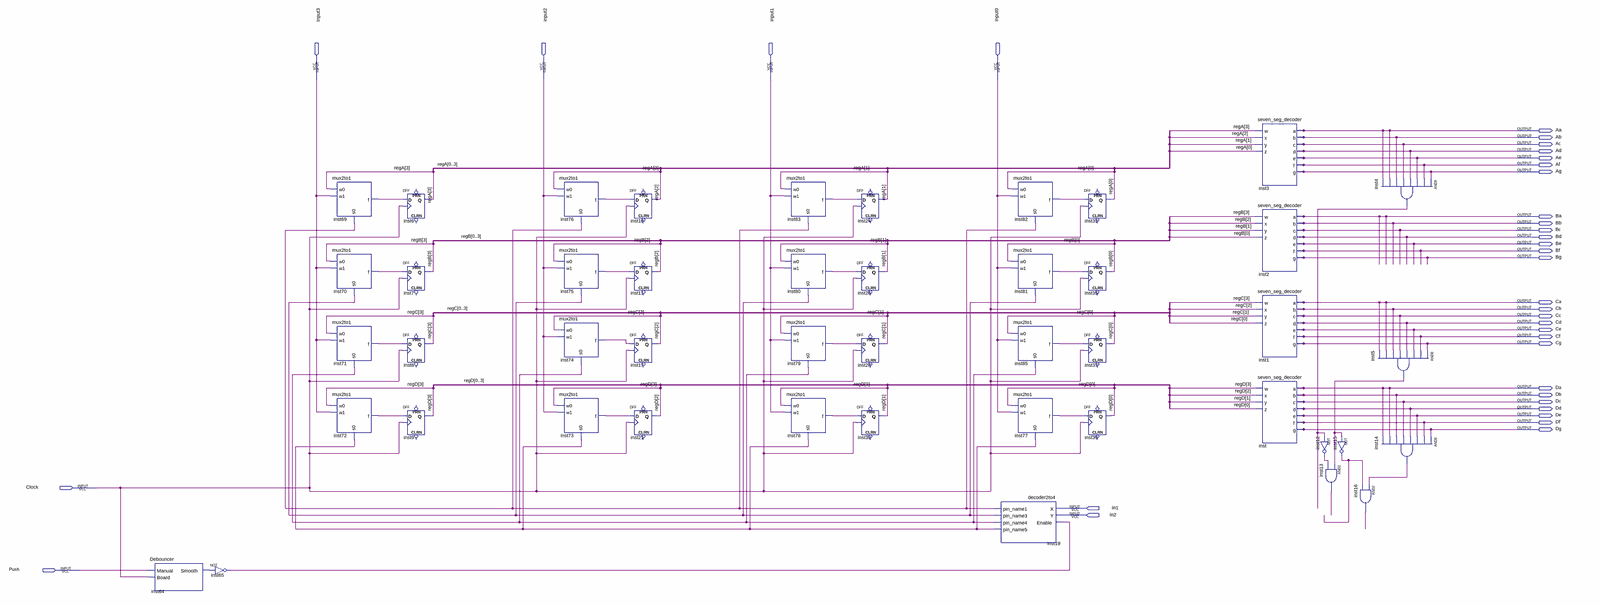
[diagram p0: schematic sheet, whole]
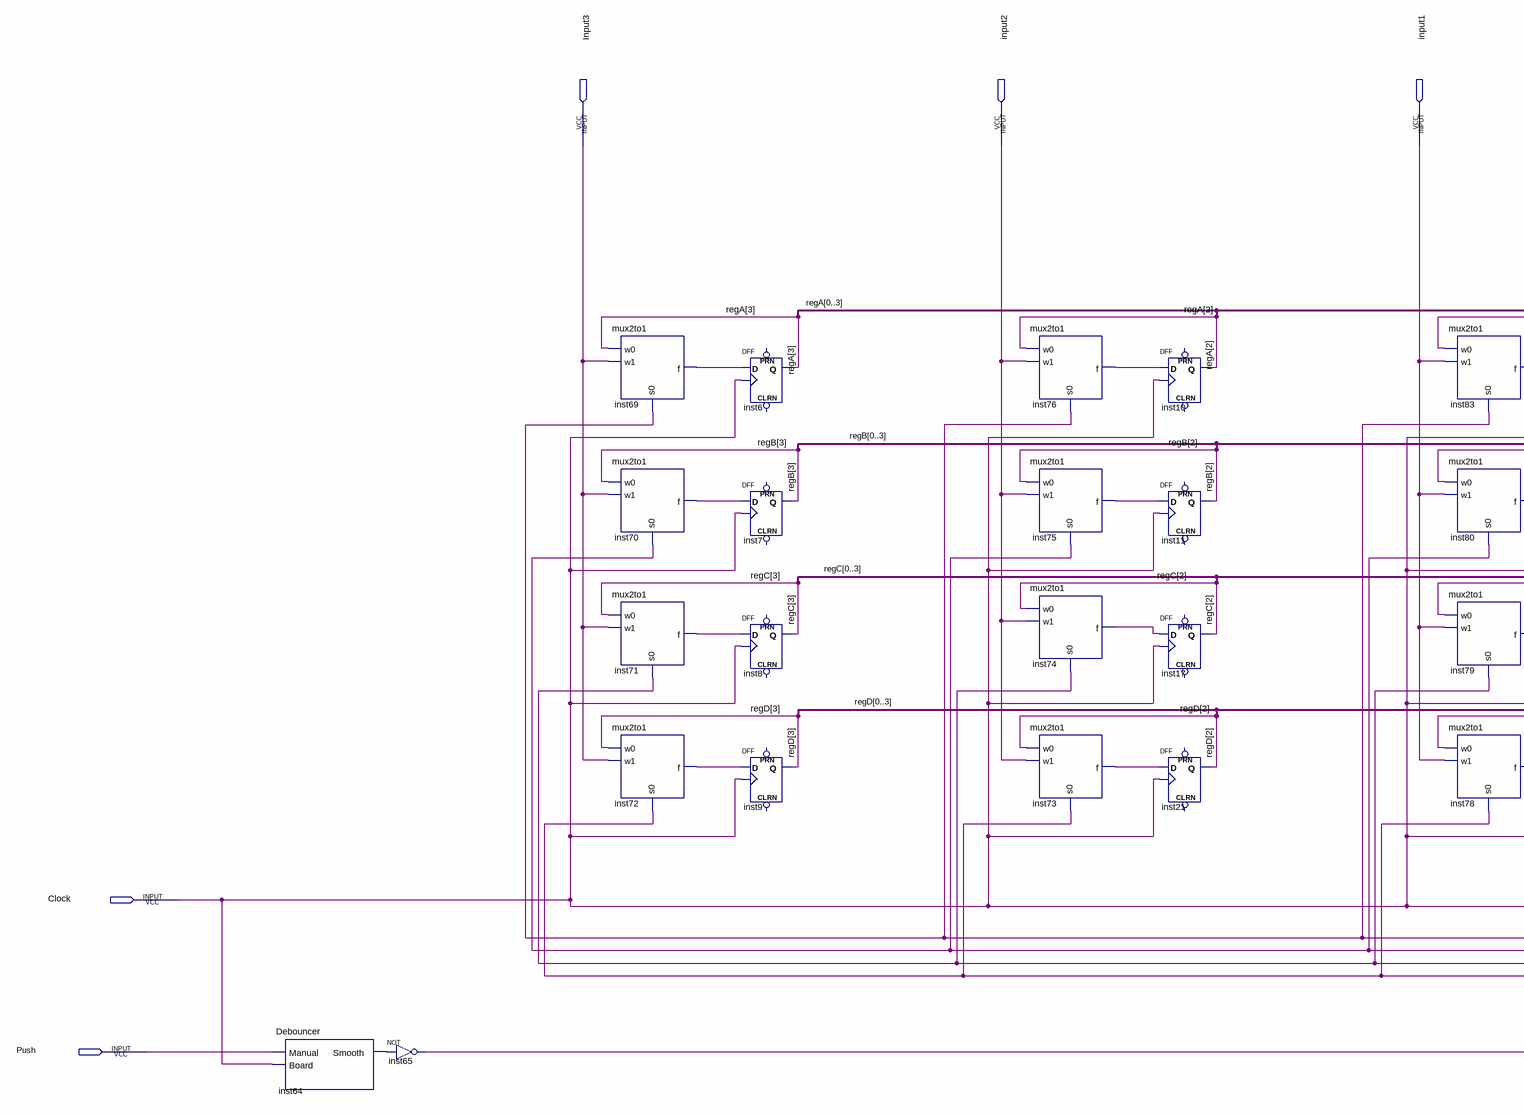
[diagram p1: schematic sheet, left part]
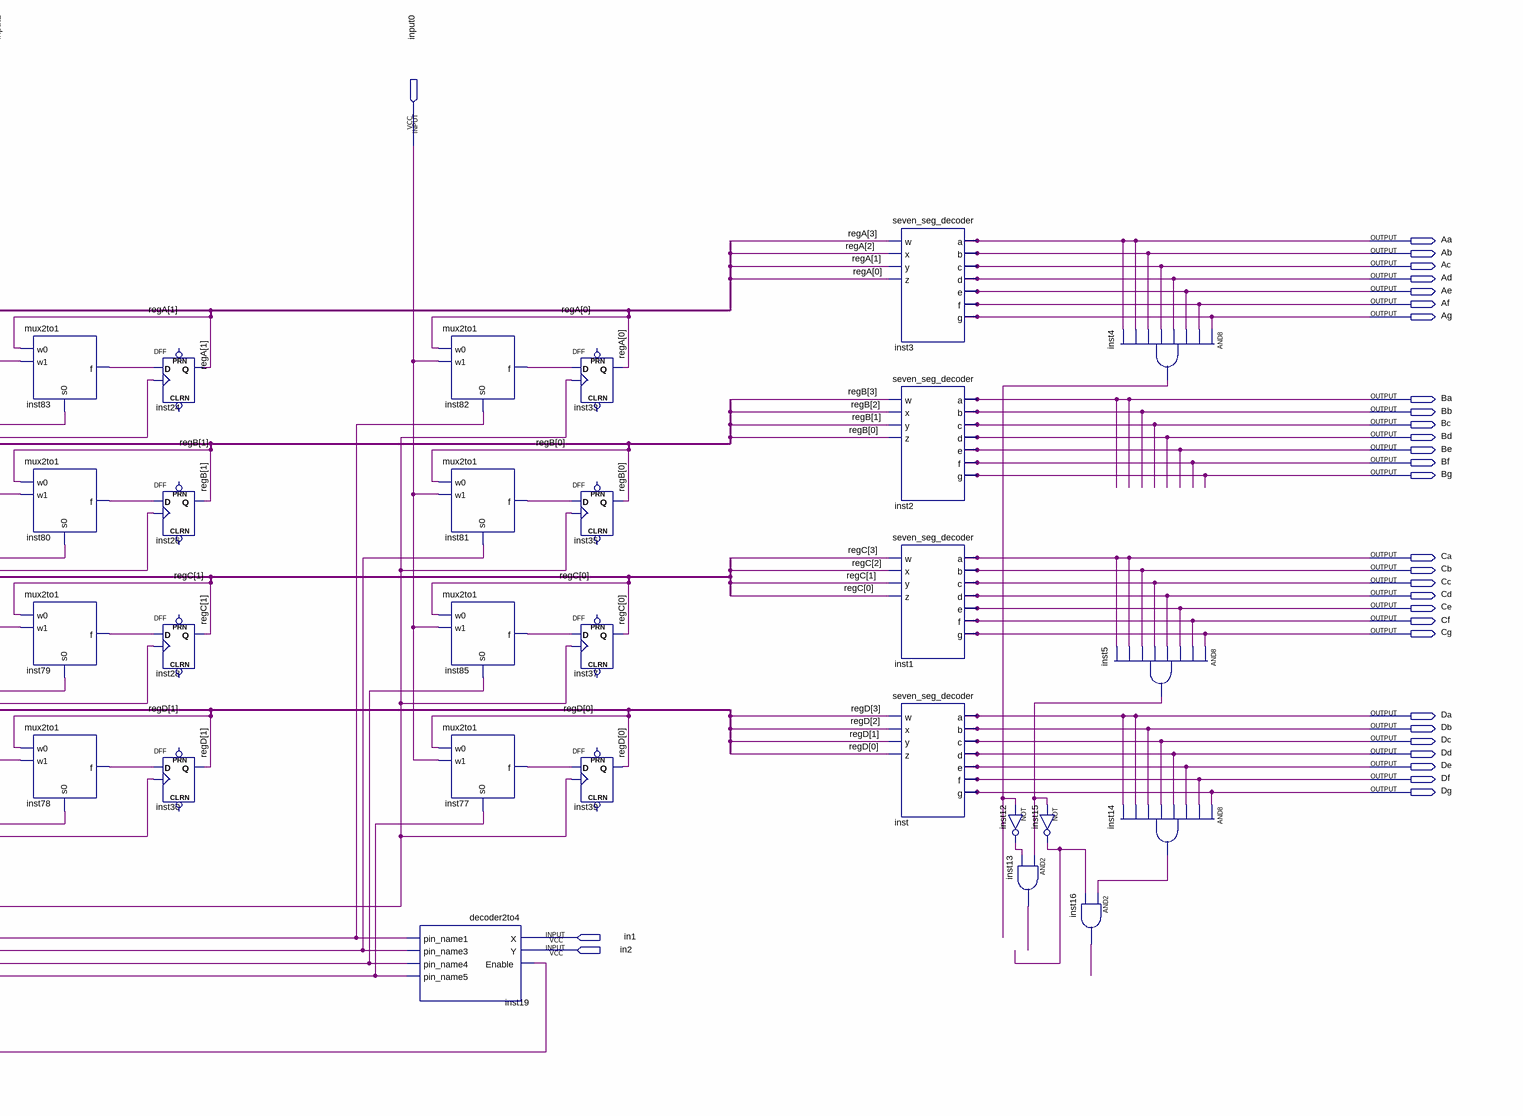
[diagram p2: schematic sheet, right part]
// Quartus schematic register.bdf as structural Verilog: 46 symbols, 36 pins
module register (
  input  Input3,
  input  input2,
  input  input1,
  input  input0,
  input  Clock,
  input  in1,
  input  in2,
  input  Push,
  output Aa,
  output Ab,
  output Ac,
  output Ad,
  output Ae,
  output Af,
  output Ag,
  output Ba,
  output Bb,
  output Bc,
  output Bd,
  output Be,
  output Bf,
  output Bg,
  output Ca,
  output Cb,
  output Cc,
  output Cd,
  output Ce,
  output Cf,
  output Cg,
  output Da,
  output Db,
  output Dc,
  output Dd,
  output De,
  output Df,
  output Dg
);

  wire inst4_out, inst5_out, inst12_out, inst13_out, inst14_out, inst15_out, inst16_out, inst19_pin_name1,
       inst19_pin_name3, inst19_pin_name4, inst19_pin_name5, inst64_smooth, inst65_out, inst69_f, inst70_f,
       inst71_f, inst72_f, inst73_f, inst74_f, inst75_f, inst76_f, inst77_f, inst78_f, inst79_f, inst80_f,
       inst81_f, inst82_f, inst83_f, inst85_f;
  wire [3:0] regA, regB, regC, regD;

  Debouncer inst64 (.Manual(Push), .Board(Clock), .Smooth(inst64_smooth));
  not inst65 (inst65_out, inst64_smooth);
  mux2to1 inst69 (.w1(Input3), .w0(regA[3]), .s0(inst19_pin_name1), .f(inst69_f));
  mux2to1 inst70 (.w1(Input3), .w0(regB[3]), .s0(inst19_pin_name3), .f(inst70_f));
  mux2to1 inst71 (.w1(Input3), .w0(regC[3]), .s0(inst19_pin_name4), .f(inst71_f));
  mux2to1 inst72 (.w1(Input3), .w0(regD[3]), .s0(inst19_pin_name5), .f(inst72_f));
  DFF inst6 (.CLK(Clock), .D(inst69_f), .Q(regA[3]));  // open: CLRN, PRN
  DFF inst7 (.CLK(Clock), .D(inst70_f), .Q(regB[3]));  // open: CLRN, PRN
  DFF inst8 (.CLK(Clock), .D(inst71_f), .Q(regC[3]));  // open: CLRN, PRN
  DFF inst9 (.CLK(Clock), .D(inst72_f), .Q(regD[3]));  // open: CLRN, PRN
  mux2to1 inst76 (.w1(input2), .w0(regA[2]), .s0(inst19_pin_name1), .f(inst76_f));
  mux2to1 inst75 (.w1(input2), .w0(regB[2]), .s0(inst19_pin_name3), .f(inst75_f));
  mux2to1 inst74 (.w1(input2), .w0(regC[2]), .s0(inst19_pin_name4), .f(inst74_f));
  mux2to1 inst73 (.w1(input2), .w0(regD[2]), .s0(inst19_pin_name5), .f(inst73_f));
  DFF inst10 (.CLK(Clock), .D(inst76_f), .Q(regA[2]));  // open: CLRN, PRN
  DFF inst11 (.CLK(Clock), .D(inst75_f), .Q(regB[2]));  // open: CLRN, PRN
  DFF inst17 (.CLK(Clock), .D(inst74_f), .Q(regC[2]));  // open: CLRN, PRN
  DFF inst21 (.CLK(Clock), .D(inst73_f), .Q(regD[2]));  // open: CLRN, PRN
  mux2to1 inst83 (.w1(input1), .w0(regA[1]), .s0(inst19_pin_name1), .f(inst83_f));
  mux2to1 inst80 (.w1(input1), .w0(regB[1]), .s0(inst19_pin_name3), .f(inst80_f));
  mux2to1 inst79 (.w1(input1), .w0(regC[1]), .s0(inst19_pin_name4), .f(inst79_f));
  mux2to1 inst78 (.w1(input1), .w0(regD[1]), .s0(inst19_pin_name5), .f(inst78_f));
  DFF inst24 (.CLK(Clock), .D(inst83_f), .Q(regA[1]));  // open: CLRN, PRN
  DFF inst26 (.CLK(Clock), .D(inst80_f), .Q(regB[1]));  // open: CLRN, PRN
  DFF inst28 (.CLK(Clock), .D(inst79_f), .Q(regC[1]));  // open: CLRN, PRN
  DFF inst30 (.CLK(Clock), .D(inst78_f), .Q(regD[1]));  // open: CLRN, PRN
  decoder2to4 inst19 (
    .X(in1), .Y(in2), .Enable(inst65_out), .pin_name1(inst19_pin_name1), .pin_name3(inst19_pin_name3),
    .pin_name4(inst19_pin_name4), .pin_name5(inst19_pin_name5));
  mux2to1 inst82 (.w1(input0), .w0(regA[0]), .s0(inst19_pin_name1), .f(inst82_f));
  mux2to1 inst81 (.w1(input0), .w0(regB[0]), .s0(inst19_pin_name3), .f(inst81_f));
  mux2to1 inst85 (.w1(input0), .w0(regC[0]), .s0(inst19_pin_name4), .f(inst85_f));
  mux2to1 inst77 (.w1(input0), .w0(regD[0]), .s0(inst19_pin_name5), .f(inst77_f));
  DFF inst33 (.CLK(Clock), .D(inst82_f), .Q(regA[0]));  // open: CLRN, PRN
  DFF inst35 (.CLK(Clock), .D(inst81_f), .Q(regB[0]));  // open: CLRN, PRN
  DFF inst37 (.CLK(Clock), .D(inst85_f), .Q(regC[0]));  // open: CLRN, PRN
  DFF inst39 (.CLK(Clock), .D(inst77_f), .Q(regD[0]));  // open: CLRN, PRN
  seven_seg_decoder inst3 (
    .w(regA[3]), .x(regA[2]), .y(regA[1]), .z(regA[0]), .a(Aa), .b(Ab), .c(Ac), .d(Ad), .e(Ae), .f(Af), .g(Ag));
  seven_seg_decoder inst2 (
    .w(regB[3]), .x(regB[2]), .y(regB[1]), .z(regB[0]), .a(Ba), .b(Bb), .c(Bc), .d(Bd), .e(Be), .f(Bf), .g(Bg));
  seven_seg_decoder inst1 (
    .w(regC[3]), .x(regC[2]), .y(regC[1]), .z(regC[0]), .a(Ca), .b(Cb), .c(Cc), .d(Cd), .e(Ce), .f(Cf), .g(Cg));
  seven_seg_decoder inst (
    .w(regD[3]), .x(regD[2]), .y(regD[1]), .z(regD[0]), .a(Da), .b(Db), .c(Dc), .d(Dd), .e(De), .f(Df), .g(Dg));
  not inst12 (inst12_out, inst4_out);
  and inst13 (inst13_out, inst5_out, inst12_out);
  not inst15 (inst15_out, inst5_out);
  and inst4 (inst4_out, Ag, Af, Ae, Ad, Ac, Ab, Aa, Aa);
  and inst5 (inst5_out, Cg, Cf, Ce, Cd, Cc, Cb, Ca, Ca);
  and inst14 (inst14_out, Dg, Df, De, Dd, Dc, Db, Da, Da);
  and inst16 (inst16_out, inst14_out, inst15_out);
endmodule
